# EAGLE schematic preScale-Mb501 (EAGLE 5.07)
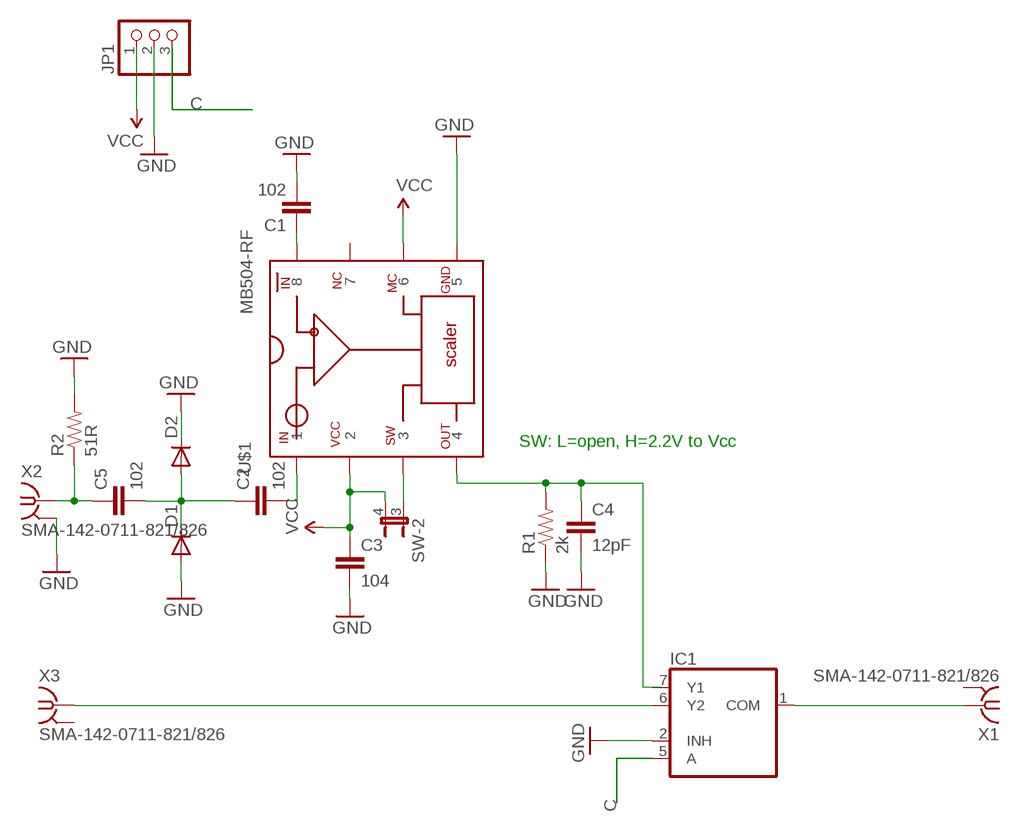
[diagram p0: schematic, sheet 1]

## Parts
C1  102  CAP-C0805  [C0805]
C2  102  CAP-C0805  [C0805]
C3  104  CAP-C0805  [C0805]
C4  12pF  CAP-C0805  [C0805]
C5  102  CAP-C0805  [C0805]
D1  DIODE1206  [1206-DIODE]
D2  DIODE1206  [1206-DIODE]
IC1  741G53DCU  [DCU_R-PDSO-G8]
JP1  PINHD-1X3PTH  [1X03]
R1  2k  RESISTOR0805  [0805]
R2  51R  RESISTOR0805  [0805]
SW  JP2QE-2X2  [JP2Q]
U$1  MB504-RF  [DIP8-RF]
X1  SMA-142-0711-821/826  [J502-ND-142-0711-821/826]
X2  SMA-142-0711-821/826  [J502-ND-142-0711-821/826]
X3  SMA-142-0711-821/826  [J502-ND-142-0711-821/826]

## Nets
C: IC1.5(A) JP1.3
GND: C1.2 C3.2 C4.2 D1.A D2.K(C) IC1.2(INH) JP1.2 R1.1 R2.2 U$1.P$5 X2.G@1(GND)
N$1: C1.1 U$1.P$8
N$2: C2.2 U$1.P$1
N$3: C2.1 C5.2 D1.K(C) D2.A
N$4: C4.1 R1.2 U$1.P$4
N$5: C5.1 R2.1 X2.1
N$6: IC1.1(COM) X1.1
N$7: SW.3 U$1.P$3
N$8: IC1.6(Y2) X3.1
VCC: C3.1 JP1.1 SW.4 U$1.P$2 U$1.P$6
Unconnected: IC1.7(Y1) SW.1 SW.2 U$1.P$7

## Notes on the sheet
- SW: L=open, H=2.2V to Vcc

## Power pins joined to a net without a drawn wire
GND: IC1.3(GND) IC1.4(GND) X1.G@1(GND) X1.G@2(GND) X1.G@3(GND) X1.G@4(GND) X2.G@2(GND) X2.G@3(GND) X2.G@4(GND) X3.G@1(GND) X3.G@2(GND) X3.G@3(GND) X3.G@4(GND)
VCC: IC1.8(VCC)

## Library data of the parts
C1-C5 = digital-toy:CAP: Capacitor Standard 0603 ceramic capacitor, and 0.1" leaded capacitor.
D1 D2 = digital-toy:DIODE: Diode These are standard reverse protection diodes and small signal diodes. SMA package can handle up to about 1A. SOD-323 can handle about 200mA. What the SOD-323 package when ordering, there are some mfgs out there that are 5-pin packages.
IC1 = 74xx-little-de:74*1G53: SINGLE-POLE DOUBLE-THROW (SPDT) ANALOG SWITCH 2:1 ANALOG MULTIPLEXER/DEMULTIPLEXER Source: http://focus.ti.com/lit/ds/symlink/sn74lvc2g53.pdf
JP1 = digital-toy:PINHD-1X3: PIN HEADER
R1 R2 = digital-toy:RESISTOR: Resistor Basic schematic elements and footprints for 0603, 1206, and PTH 1/10th watt (small) resistors. digital-toy copy vertical mount of axial-0.3 from rcl.lbr : the 0207/xx
SW = digital-toy:JP2QE: JUMPER
U$1 = dtoy-RF:MB504: MB501/504 by hyl 2011.4.8
X1-X3 = con-coax:SMA-: SMA 50 Ohm End Launch Jack Receptacle - Round Contact Johnson Components Source: www.johnsoncomponents.com .. J502-ND.pdf